# Altium schematic sheet CON_RS232DCE_RJ45.SchDoc: RS232-DCE DB9 Female
size A4; Organization: Altium Limited.; Address1: Level 3, 12a Rodborough Rd; Address2: Frenchs Forest 2086; Address3: NSW; Address4: AUSTRALIA; Revision: 6; SheetNumber: 50; SheetTotal: 64
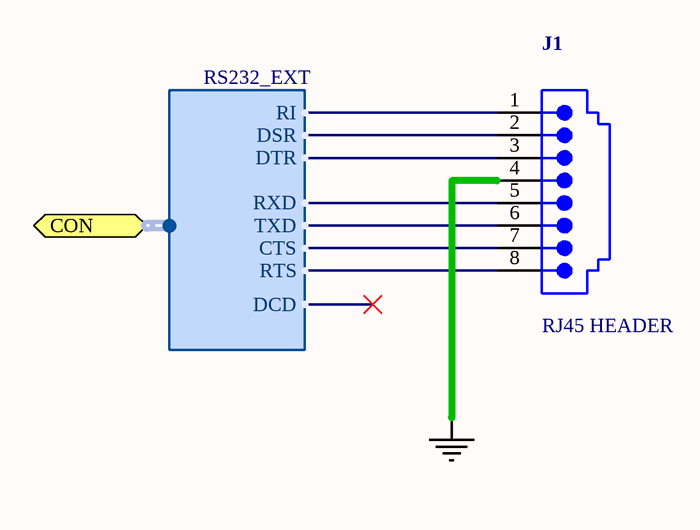
[diagram p0: CON_RS232DCE_RJ45.SchDoc]

## Parts
J1  RJ45 HEADER  [15-43-6233]

## Ports
CON (harness RS232_EXT)

## Harnesses
RS232_EXT: DCD, RXD, TXD, DTR, DSR, RTS, CTS, RI

## Nets
GND: J1.4
NetJ1_1: J1.1 ; port CON.RI
NetJ1_2: J1.2 ; port CON.DSR
NetJ1_3: J1.3 ; port CON.DTR
NetJ1_5: J1.5 ; port CON.RXD
NetJ1_6: J1.6 ; port CON.TXD
NetJ1_7: J1.7 ; port CON.CTS
NetJ1_8: J1.8 ; port CON.RTS

## Notes on the sheet
- Sheet Title
- Project Title
- Size:
- Date:
- A4
- Assy:
- Time:
- Sheet
- Revision:
- of
- File:

## Library data of the parts
J1 = D-300-0005: Connector, RJ45 Socket, Right-Angle, 8 Way (Ethernet), PCM8P8C; Category: Connector; Connector type: RJ45 HEADER; Status: Production